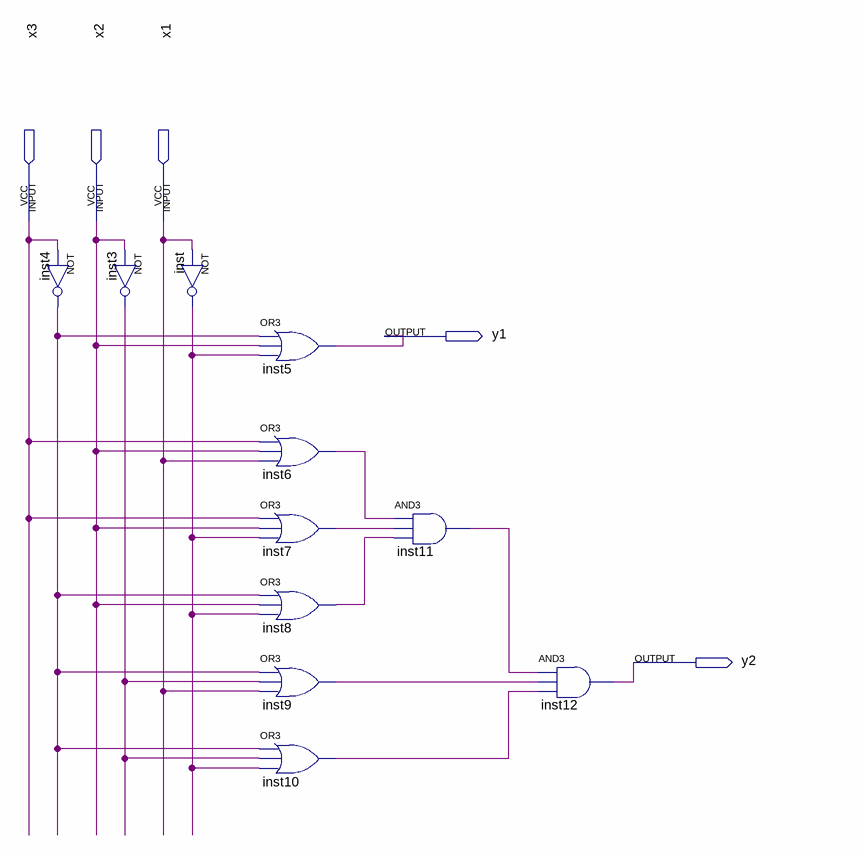
[diagram p0: schematic sheet]
// Quartus schematic L0104.bdf as structural Verilog: 11 symbols, 5 pins
module L0104 (
  input  x3,
  input  x2,
  input  x1,
  output y1,
  output y2
);

  wire inst3_out, inst4_out, inst6_out, inst7_out, inst8_out, inst9_out, inst10_out, inst11_out, inst_out;

  not inst4 (inst4_out, x3);
  not inst3 (inst3_out, x2);
  not inst (inst_out, x1);
  or inst5 (y1, inst4_out, x2, inst_out);
  or inst6 (inst6_out, x3, x2, x1);
  or inst7 (inst7_out, x3, x2, inst_out);
  or inst8 (inst8_out, inst4_out, x2, inst_out);
  or inst9 (inst9_out, inst4_out, inst3_out, x1);
  or inst10 (inst10_out, inst4_out, inst3_out, inst_out);
  and inst11 (inst11_out, inst6_out, inst7_out, inst8_out);
  and inst12 (y2, inst11_out, inst9_out, inst10_out);
endmodule
